# Altium schematic sheet Quad FC power V10.7-final.SchDoc
size A4; SheetNumber: 2; SheetTotal: 2
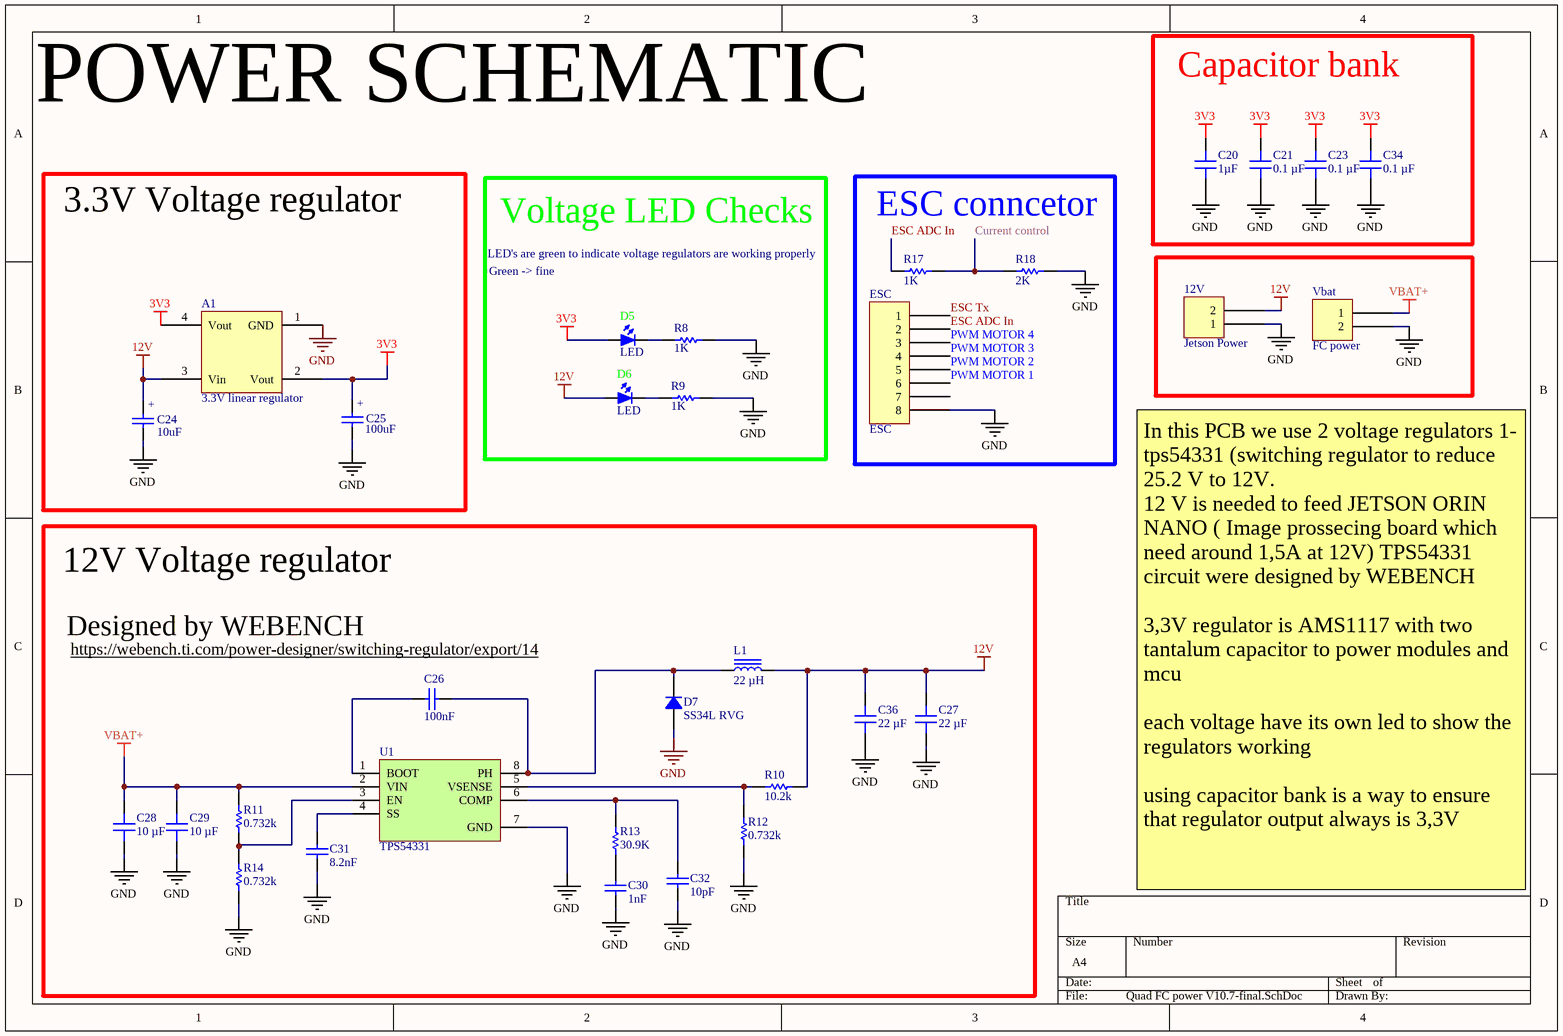
[diagram p0: Quad FC power V10.7-final.SchDoc]

## Parts
12V  Jetson Power  [JST XH B2B-XH-A]
A1  3.3V linear regulator  [SOT230P700X180-4N]
C20  1µF  [CAP 0805_2012]
C21  0.1 µF  [CAP 0805_2012]
C23  0.1 µF  [CAP 0805_2012]
C24  10uF  [MY_CAP_SMD-B]
C25  100uF  [MY_CAP_SMD-B]
C26  100nF  [CAP0603]
C27  value 22 µF  [CAP 0805_2012]  (hidden comment: 22uF)
C28  10 µF  [CAP 0805_2012]
C29  10 µF  [CAP 0805_2012]
C30  1nF  [CAP0603]
C31  8.2nF  [CAP0603]
C32  10pF  [CAP0603]
C34  0.1 µF  [CAP 0805_2012]
C36  value 22 µF  [CAP 0805_2012]  (hidden comment: 22uF)
D5  LED  [0603 - LED]
D6  LED  [0603 - LED]
D7  SS34L RVG  [SMF DO-219AB]
ESC  ESC  [JST SM08B-SRSS-TB]
L1  22 µH  [TAIYO YUDEN NRS8030]
R8  1K  [RES0603]
R9  1K  [RES0603]
R10  10.2k  [RES0603]
R11  0.732k  [RES0603]
R12  0.732k  [RES0603]
R13  30.9K  [RES0603]
R14  0.732k  [RES0603]
R17  1K  [RES0603]
R18  2K  [RES0603]
U1  TPS54331  [SO8]
Vbat  FC power  [JST XH B2B-XH-A]

## Blocks framed on the sheet
Capacitor bank: C20 C21 C23 C34
3.3V Voltage regulator: A1 C24 C25
Voltage LED Checks: D5 D6 R8 R9
ESC conncetor: ESC R17 R18
12V Voltage regulator: C26-C32 C36 D7 L1 R10-R14 U1

## Nets
3V3: A1.2(Vout) A1.4(Vout) C20.2 C21.2 C23.2 C25.+ C34.2 D5.1(A)
12V: 12V.2 A1.3(Vin) C24.+ C27.2 C36.2 D6.1(A) L1.2 R10.2
GND: 12V.1 A1.1(GND) C20.1 C21.1 C23.1 C24.- C25.- C27.1 C28.1 C29.1 C30.2 C31.2 C32.2 C34.1 C36.1 D7.1 ESC.8 R8.2 R9.2 R12.1 R14.1 R18.1 U1.7(GND) Vbat.2
VBAT+: C28.2 C29.2 R11.2 U1.2(VIN) Vbat.1
Current control: R17.1 R18.2
ESC ADC In: ESC.2 R17.2
ESC Tx: ESC.1
PWM MOTOR 1: ESC.6
PWM MOTOR 2: ESC.5
PWM MOTOR 3: ESC.4
PWM MOTOR 4: ESC.3
NetC26_1: C26.1 D7.2 L1.1 U1.8(PH)
NetC26_2: C26.2 U1.1(BOOT)
NetC30_1: C30.1 R13.1
NetC31_1: C31.1 U1.4(SS)
NetC32_1: C32.1 R13.2 U1.6(COMP)
NetD5_2: D5.2(K) R8.1
NetD6_2: D6.2(K) R9.1
NetR10_1: R10.1 R12.2 U1.5(VSENSE)
NetR11_1: R11.1 R14.2 U1.3(EN)

Not connected (* = marked no-connect by the designer): ESC 7

## Notes on the sheet
- POWER SCHEMATIC
- (near R17) LED's are green to indicate voltage regulators are working properly
- Green -> fine
- Designed by WEBENCH
- https://webench.ti.com/power-designer/switching-regulator/export/14
- In this PCB we use 2 voltage regulators 1- tps54331 (switching regulator to reduce 25.2 V to 12V.
  12 V is needed to feed JETSON ORIN NANO ( Image prossecing board which need around 1,5A at 12V) TPS54331 circuit were designed by WEBENCH
  3,3V regulator is AMS1117 with two tantalum capacitor to power modules and mcu
  each voltage have its own led to show the regulators working
  using capacitor bank is a way to ensure that regulator output always is 3,3V

## Library data of the parts
12V Vbat = B2B-XH-A(LF)(SN): CONN HEADER VERT 2POS 2.5MM; Manufacturer: JST Sales America Inc.; Contact Length - Post: 0.134" (3.40mm); Current Rating (Amps): 3A; Material Flammability Rating: UL94 V-0; Number of Positions: 2; Number of Positions Loaded: All; Pitch - Mating: 0.098" (2.50mm); Shrouding: Shrouded - 4 Wall; Style: Board to Cable/Wire; Voltage Rating: 250V; Part Number: B2B-XH-A(LF)(SN); ComponentLink1Description: Datasheet; ComponentLink1URL: http://www.jst-mfg.com/product/pdf/eng/eXH.pdf; ComponentLink2Description: DigiKey Link; ComponentLink2URL: http://digikey.com/product-detail/en/jst-sales-america-inc/B2B-XH-A-LF-SN/455-2247-ND/1651045; Connector Type: Header; Contact Finish - Mating: Tin; Contact Finish - Post: Tin; Contact Material: Brass; Contact Shape: Square; Contact Type: Male Pin; Fastening Type: Detent Lock; Insulation Color: Natural; Insulation Height: 0.276" (7.00mm); Insulation Material: Polyamide (PA66), Nylon 6/6; LastUpdated: 1/12/2020 11:46:08 PM; Lifecycle Status: Active; Minimum Order: 1; Mounting Type: Through Hole; Number of Rows: 1; Operating Temperature: -25°C ~ 85°C; Packaging: Bulk; PartId: 67; Part Status: Active; Price: 0.15; Series: XH; Supplier 1: DigiKey; Supplier Part Number 1: 455-2247-ND; Termination: Press-Fit, Solder
A1 = ams1117
C20 = MM05ZC105KCZ2A: CAP CER 1UF 10V X7R 0805; manufacturer: AVX Corporation; Tolerance: ±10%; Part Number: MM05ZC105KCZ2A; Value: 1µF; Applications: Medical, Non-Critical; Capacitance: 1µF; componentlink1description: Datasheet; componentlink1url: http://datasheets.avx.com/AVX-MM.pdf; componentlink2description: DigiKey Link; componentlink2url: http://digikey.com/product-detail/en/avx-corporation/MM05ZC105KCZ2A/478-10611-1-ND/7344872; Device Package: 0805 (2012 Metric); lastupdated: 9/2/2020 1:04:42 AM; Lifecycle Status: Active; Minimum Order: 1; Mounting Type: Surface Mount, MLCC; Operating Temperature: -55°C ~ 125°C; Package / Case: 0805 (2012 Metric); packaging: TapeAndReel; partid: 2439; Part Status: Active; price: 0.50; series: MM; Size / Dimension: 0.079" L x 0.049" W (2.01mm x 1.25mm); Supplier 1: DigiKey; Supplier Part Number 1: 478-10611-1-ND; Temperature Coefficient: X7R; Thickness (Max): 0.029" (0.74mm); Voltage - Rated: 10V
C21 C23 C34 = CC0805MRX7R9BB104: CAP CER 0.1UF 50V X7R 0805; manufacturer: Yageo; Tolerance: ±20%; Part Number: CC0805MRX7R9BB104; Value: 0.1 µF; Applications: General Purpose; Capacitance: 0.1 µF; componentlink1description: Datasheet; componentlink1url: https://www.yageo.com/upload/media/product/productsearch/datasheet/mlcc/UPY-GPHC_X7R_6.3V-to-50V_18.pdf; componentlink2description: DigiKey Link; componentlink2url: https://www.digikey.com/en/products/detail/yageo/CC0805MRX7R9BB104/5884281; Device Package: 0805 (2012 Metric); lastupdated: 2/9/2024 8:16:09 PM; Lifecycle Status: Active; Minimum Order: 1; Mounting Type: Surface Mount, MLCC; Operating Temperature: -55°C ~ 125°C; Package / Case: 0805 (2012 Metric); packaging: TapeAndReel; partid: 2475; Part Status: Active; price: 0.01; series: CC; Size / Dimension: 0.079" L x 0.049" W (2.00mm x 1.25mm); Supplier 1: DigiKey; Supplier Part Number 1: 311-4351-1-ND; Temperature Coefficient: X7R; Thickness (Max): 0.037" (0.95mm); Voltage - Rated: 50V
C24 C25 = CAP_TANTAL_B: 3.5X2.8MM; Value: 3300u
C26 C30-C32 = CAP SMD PACKAGE: F407VET6 Power CAP; Designer: Abbas Basereh; Desc.: CAP SMD TOTAL PACKAGES; Data: 2017-3-10
C27 C36 = GRM21BR61H106KE43K: CAP CER 10UF 50V X5R 0805; manufacturer: Murata Electronics; Capacitance: 10 µF; Tolerance: ±10%; Part Number: GRM21BR61H106KE43K; Applications: General Purpose; componentlink1description: Datasheet; componentlink1url: https://search.murata.co.jp/Ceramy/image/img/A01X/G101/ENG/GRM21BR61H106KE43-01A.pdf; componentlink2description: DigiKey Link; componentlink2url: https://www.digikey.com/en/products/detail/murata-electronics/GRM21BR61H106KE43K/15191954; Device Package: 0805 (2012 Metric); lastupdated: 2/9/2024 8:15:01 PM; Lifecycle Status: Active; Minimum Order: 1; Mounting Type: Surface Mount, MLCC; Operating Temperature: -55°C ~ 85°C; Package / Case: 0805 (2012 Metric); packaging: TapeAndReel; partid: 40508; Part Status: Active; price: 0.05; series: GRM; Size / Dimension: 0.079" L x 0.049" W (2.00mm x 1.25mm); Supplier 1: DigiKey; Supplier Part Number 1: 490-GRM21BR61H106KE43KCT-ND; Temperature Coefficient: X5R; Thickness (Max): 0.057" (1.45mm); Voltage - Rated: 50V
C28 C29 = GRM21BR61H106KE43K: CAP CER 10UF 50V X5R 0805; manufacturer: Murata Electronics; Tolerance: ±10%; Part Number: GRM21BR61H106KE43K; Value: 10 µF; Applications: General Purpose; Capacitance: 10 µF; componentlink1description: Datasheet; componentlink1url: https://search.murata.co.jp/Ceramy/image/img/A01X/G101/ENG/GRM21BR61H106KE43-01A.pdf; componentlink2description: DigiKey Link; componentlink2url: https://www.digikey.com/en/products/detail/murata-electronics/GRM21BR61H106KE43K/15191954; Device Package: 0805 (2012 Metric); lastupdated: 2/9/2024 8:15:01 PM; Lifecycle Status: Active; Minimum Order: 1; Mounting Type: Surface Mount, MLCC; Operating Temperature: -55°C ~ 85°C; Package / Case: 0805 (2012 Metric); packaging: TapeAndReel; partid: 40508; Part Status: Active; price: 0.05; series: GRM; Size / Dimension: 0.079" L x 0.049" W (2.00mm x 1.25mm); Supplier 1: DigiKey; Supplier Part Number 1: 490-GRM21BR61H106KE43KCT-ND; Temperature Coefficient: X5R; Thickness (Max): 0.057" (1.45mm); Voltage - Rated: 50V
D7 = SS34L RVG: DIODE SCHOTTKY 40V 3A SUB SMA; Manufacturer: Taiwan Semiconductor Corporation; Current - Reverse Leakage @ Vr: 500 µA @ 40 V; Speed: Fast Recovery =< 500ns, > 200mA (Io); Voltage - Forward (Vf) (Max) @ If: 500 mV @ 3 A; Part Number: SS34L RVG; ComponentLink1Description: Datasheet; ComponentLink1URL: https://www.taiwansemi.com/products/datasheet/SS34L%20SERIES_B14.pdf; ComponentLink2Description: DigiKey Link; ComponentLink2URL: https://www.digikey.com/en/products/detail/taiwan-semiconductor-corporation/SS34L-RVG/7359609; Current - Average Rectified (Io): 3A; Diode Type: Schottky; LastUpdated: 2/8/2024 9:37:23 PM; Lifecycle Status: Active; Minimum Order: 1; Mounting Type: Surface Mount; Operating Temperature - Junction: -55°C ~ 150°C; Package / Case: DO-219AB; Packaging: TapeAndReel; PartId: 1293; Part Status: Active; Price: 0.13; Series: -; Supplier 1: DigiKey; Supplier Part Number 1: SS34LRVGCT-ND; Supplier Device Package: Sub SMA; Voltage - DC Reverse (Vr) (Max): 40 V
ESC = SM08B-SRSS-TB(LF)(SN): CONN HEADER SMD R/A 8POS 1MM; Manufacturer: JST Sales America Inc.; Current Rating (Amps): 0.7A; Material Flammability Rating: UL94 V-0; Number of Positions: 8; Number of Positions Loaded: All; Pitch - Mating: 0.039" (1.00mm); Shrouding: Shrouded - 4 Wall; Style: Board to Cable/Wire; Voltage Rating: 50V; Part Number: SM08B-SRSS-TB(LF)(SN); ComponentLink1Description: Datasheet; ComponentLink1URL: http://www.jst-mfg.com/product/pdf/eng/eSH.pdf; ComponentLink2Description: DigiKey Link; ComponentLink2URL: http://digikey.com/product-detail/en/jst-sales-america-inc/SM08B-SRSS-TB-LF-SN/455-1808-1-ND/926879; Connector Type: Header; Contact Finish - Mating: Tin; Contact Finish - Post: Tin; Contact Material: Copper Alloy; Contact Shape: Square; Contact Type: Male Pin; Fastening Type: Push-Pull; Features: Solder Retention; Insulation Color: Natural; Insulation Height: 0.114" (2.90mm); Insulation Material: Polyamide (PA), Nylon; LastUpdated: 1/12/2020 11:42:39 PM; Lifecycle Status: Active; Minimum Order: 1; Mounting Type: Surface Mount, Right Angle; Number of Rows: 1; Operating Temperature: -25°C ~ 85°C; Packaging: TapeAndReel; PartId: 66; Part Status: Active; Price: 0.41; Series: SR; Supplier 1: DigiKey; Supplier Part Number 1: 455-1808-1-ND; Termination: Solder
L1 = NRS8030T100MJGJV: FIXED IND 10UH 3A 42.9 MOHM SMD; Manufacturer: Taiyo Yuden; Current - Saturation: 2.4A; DC Resistance (DCR): 42.9mOhm Max; Frequency - Self Resonant: 27MHz; Inductance: 10 µH; Inductance Frequency - Test: 100 kHz; Material - Core: Ferrite; Shielding: Shielded; Tolerance: ±20%; Type: Drum Core, Wirewound; Value: 10 µH; Part Number: NRS8030T100MJGJV; ComponentLink1Description: Datasheet; ComponentLink1URL: https://ds.yuden.co.jp/TYCOMPAS/ut/detail?pn=NRS8030T100MJGJV  &u=M; ComponentLink2Description: DigiKey Link; ComponentLink2URL: https://www.digikey.com/en/products/detail/taiyo-yuden/NRS8030T100MJGJV/4693986; Current Rating (Amps): 3 A; Device Package: Nonstandard; Height - Seated (Max): 0.118" (3.00mm); LastUpdated: 2/8/2024 9:55:48 PM; Lifecycle Status: Active; Minimum Order: 1; Mounting Type: Surface Mount; Operating Temperature: -40°C ~ 125°C; Package / Case: Nonstandard; Packaging: TapeAndReel; PartId: 5482; Part Status: Active; Price: 0.23; Ratings: AEC-Q200; Series: NR, S Type; Size / Dimension: 0.315" L x 0.315" W (8.00mm x 8.00mm); Supplier 1: DigiKey; Supplier Part Number 1: 587-3647-1-ND
R8-R14 R17 R18 = RES SMD PACKAGE: TOTAL SMD RESISTOR PACK; Designer: Abbas Basereh; Desc.: RES SMD PAKAGES; Data: 2017-3-10
  R8 R9 R17: VALUE: 1K
  R10: VALUE: 10.2k
  R11 R12 R14: VALUE: 0.732k
  R13: VALUE: 30.9K
  R18: VALUE: 2K
U1 = TPS54331: DC/DC Switching Regulators 2A,28V,1MHz Step Down SWIFT DC/D;Output Voltage:0.8 V to 25 V; Link: http://javanelec.com/productsDetails.aspx?id=33786
D5 D6 = LED: Published: 8-Jun-2000; LatestRevisionDate: 08-Jul-2005; LatestRevisionNote: Mech Layer 1 removed.; PackageReference: LED-0; Publisher: Altium Limited